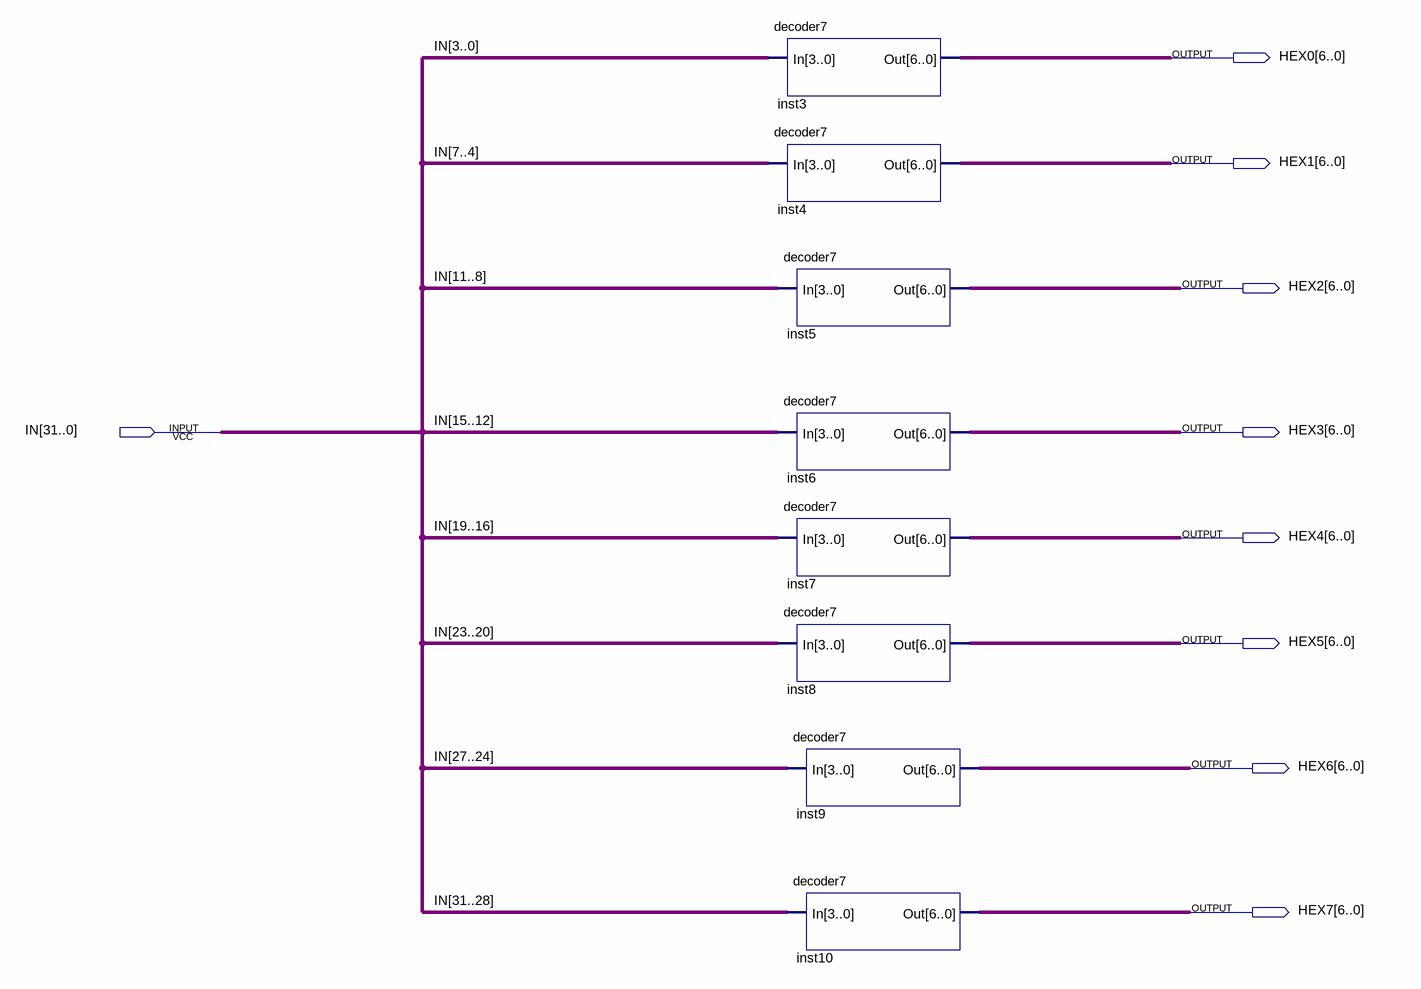
[diagram p0: schematic sheet]
// Quartus schematic bcd_test.bdf as structural Verilog: 8 symbols, 9 pins
module bcd_test (
  input  [31:0] IN,
  output [6:0] HEX0,
  output [6:0] HEX1,
  output [6:0] HEX2,
  output [6:0] HEX3,
  output [6:0] HEX4,
  output [6:0] HEX5,
  output [6:0] HEX6,
  output [6:0] HEX7
);

  decoder7 inst3 (.In(IN[3:0]), .Out(HEX0));
  decoder7 inst4 (.In(IN[7:4]), .Out(HEX1));
  decoder7 inst5 (.In(IN[11:8]), .Out(HEX2));
  decoder7 inst6 (.In(IN[15:12]), .Out(HEX3));
  decoder7 inst7 (.In(IN[19:16]), .Out(HEX4));
  decoder7 inst8 (.In(IN[23:20]), .Out(HEX5));
  decoder7 inst9 (.In(IN[27:24]), .Out(HEX6));
  decoder7 inst10 (.In(IN[31:28]), .Out(HEX7));
endmodule
